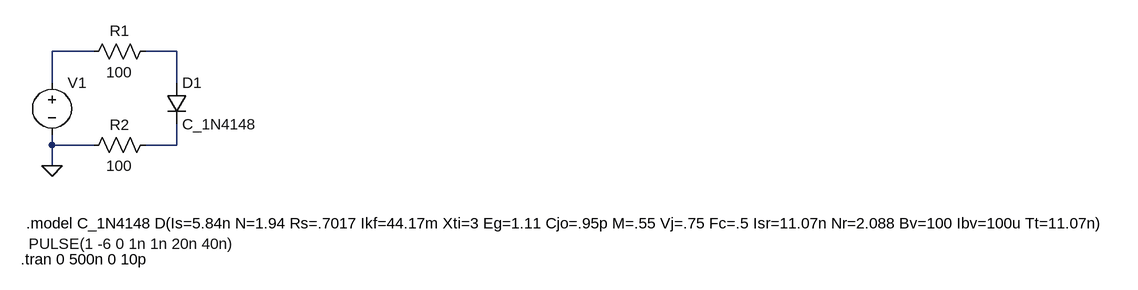
[diagram p0: schematic 1N4148_Trr.asc]
1N4148_Trr.asc, the LTspice schematic file:
Version 4.1
SHEET 1 1884 680
WIRE 128 64 64 64
WIRE 256 64 208 64
WIRE 64 112 64 64
WIRE 256 112 256 64
WIRE 64 208 64 192
WIRE 128 208 64 208
WIRE 256 208 256 176
WIRE 256 208 208 208
WIRE 64 240 64 208
FLAG 64 240 0
SYMBOL diode 240 112 R0
SYMATTR InstName D1
SYMATTR Value C_1N4148
SYMBOL voltage 64 96 R0
WINDOW 3 -36 264 Left 2
WINDOW 123 0 0 Left 0
WINDOW 39 0 0 Left 0
SYMATTR InstName V1
SYMATTR Value PULSE(1 -6 0 1n 1n 20n 40n)
SYMBOL res 224 48 R90
WINDOW 0 0 56 VBottom 2
WINDOW 3 32 56 VTop 2
SYMATTR InstName R1
SYMATTR Value 100
SYMBOL res 112 224 R270
WINDOW 0 32 56 VTop 2
WINDOW 3 0 56 VBottom 2
SYMATTR InstName R2
SYMATTR Value 100
TEXT 24 328 Left 2 !.model C_1N4148 D(Is=5.84n N=1.94 Rs=.7017 Ikf=44.17m Xti=3 Eg=1.11 Cjo=.95p M=.55 Vj=.75 Fc=.5 Isr=11.07n Nr=2.088 Bv=100 Ibv=100u Tt=11.07n)
TEXT 16 384 Left 2 !.tran 0 500n 0 10p

The netlist it stands for:
* 1N4148_Trr.asc
D1 N002 N003 C_1N4148
V1 N001 0 PULSE(1 -6 0 1n 1n 20n 40n)
R1 N002 N001 100
R2 0 N003 100
.model D D
.lib standard.dio
.model C_1N4148 D(Is=5.84n N=1.94 Rs=.7017 Ikf=44.17m Xti=3 Eg=1.11 Cjo=.95p M=.55 Vj=.75 Fc=.5 Isr=11.07n Nr=2.088 Bv=100 Ibv=100u Tt=11.07n)
.tran 0 500n 0 10p
.backanno
.end